# EAGLE design uru-card (EAGLE 9.6.2)
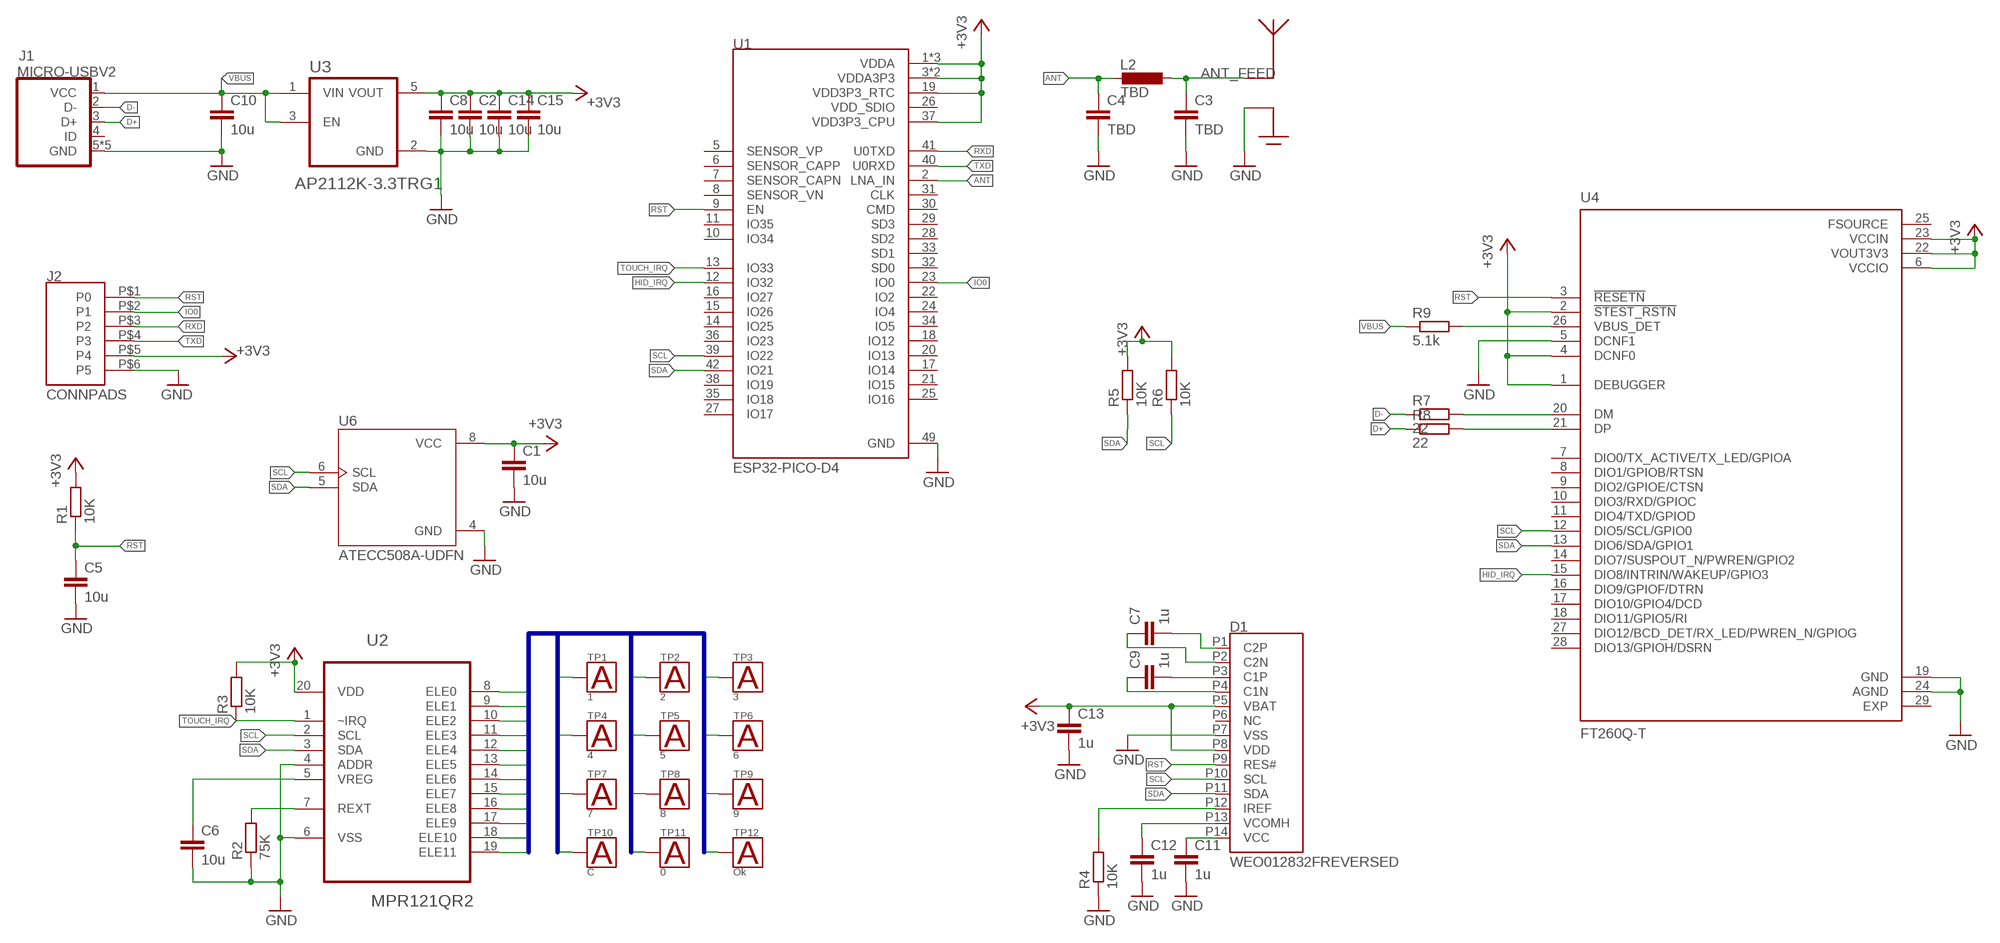
[diagram p0: schematic, sheet 1]

## Parts
C1  10u  C-EUC0603  [C0603]
C2  10u  C-EUC0603  [C0603]
C3  TBD  C-EUC0603  [C0603]
C4  TBD  C-EUC0603  [C0603]
C5  10u  C-EUC0603  [C0603]
C6  10u  C-EUC0603  [C0603]
C7  1u  C-EUC0603  [C0603]
C8  10u  C-EUC0603  [C0603]
C9  1u  C-EUC0603  [C0603]
C10  10u  C-EUC0603  [C0603]
C11  1u  C-EUC0603  [C0603]
C12  1u  C-EUC0603  [C0603]
C13  1u  C-EUC0603  [C0603]
C14  10u  C-EUC0603  [C0603]
C15  10u  C-EUC0603  [C0603]
D1  WEO012832FREVERSED  [WEO012832F-REVERSE]
J1  MICRO-USBV2  [MICRO-USB-2]
J2  CONNPADS  [PADS]
L2  TBD  L-EUL2012C  [L2012C]
R1  10K  R-EU_R0603  [R0603]
R2  75K  R-EU_R0603  [R0603]
R3  10K  R-EU_R0603  [R0603]
R4  10K  R-EU_R0603  [R0603]
R5  10K  R-EU_R0603  [R0603]
R6  10K  R-EU_R0603  [R0603]
R7  22  R-EU_R0603  [R0603]
R8  22  R-EU_R0603  [R0603]
R9  5.1k  R-EU_R0603  [R0603]
TP1  1  TOUCH  [TOUCH]
TP2  2  TOUCH  [TOUCH]
TP3  3  TOUCH  [TOUCH]
TP4  4  TOUCH  [TOUCH]
TP5  5  TOUCH  [TOUCH]
TP6  6  TOUCH  [TOUCH]
TP7  7  TOUCH  [TOUCH]
TP8  8  TOUCH  [TOUCH]
TP9  9  TOUCH  [TOUCH]
TP10  C  TOUCH  [TOUCH]
TP11  0  TOUCH  [TOUCH]
TP12  Ok  TOUCH  [TOUCH]
U1  ESP32-PICO-D4  [PQFN50P700X700X104-49N]
U2  MPR121QR2  [QFN40P300X300X60-20N]
U3  AP2112K-3.3TRG1  [SOT95P285X140-5N]
U4  FT260Q-T  [QFN50P500X500X80-29N]
U6  ATECC508A-UDFN  [SON50P200X300X60-9N]
U$15  ANT-2_4_PCB  [ANT-2_4]

## Nets
0: TP11.P$1 U2.18(ELE10)
1: TP1.P$1 U2.8(ELE0)
2: TP2.P$1 U2.9(ELE1)
3: TP3.P$1 U2.10(ELE2)
4: TP4.P$1 U2.11(ELE3)
5: TP5.P$1 U2.12(ELE4)
6: TP6.P$1 U2.13(ELE5)
7: TP7.P$1 U2.14(ELE6)
8: TP8.P$1 U2.15(ELE7)
9: TP9.P$1 U2.16(ELE8)
+3V3 [VCC]: C1.1 C2.1 C8.1 C13.1 C14.1 C15.1 D1.P5(VBAT) D1.P8(VDD) J2.P$5(P4) R1.2 R3.2 R5.2 R6.2 U1.1(VDDA) U1.3(VDDA3P3) U1.4(VDDA3P3) U1.19(VDD3P3_RTC) U1.37(VDD3P3_CPU) U1.43(VDDA) U1.46(VDDA) U2.20(VDD) U3.5(VOUT) U4.1(DEBUGGER) U4.2(!STEST_RSTN) U4.4(DCNF0) U4.6(VCCIO) U4.22(VOUT3V3) U4.23(VCCIN) U6.8(VCC)
ANT [ANT]: C4.1 L2.2 U1.2(LNA_IN)
ANT_FEED [ANT]: C3.1 L2.1 U$15.FEED
C: TP10.P$1 U2.17(ELE9)
D+: J1.3(D+) R8.1
D-: J1.2(D-) R7.1
GND [GND]: C1.2 C2.2 C3.2 C4.2 C5.2 C6.2 C8.2 C10.2 C11.2 C12.2 C13.2 C14.2 C15.2 D1.P7(VSS) J1.5(GND) J1.P$1(GND) J1.P$2(GND) J1.P$3(GND) J1.P$4(GND) J2.P$6(P5) R2.1 R4.1 U1.49(GND) U2.4(ADDR) U2.6(VSS) U3.2(GND) U4.5(DCNF1) U4.19(GND) U4.24(AGND) U6.4(GND) U$15.GND
HID_IRQ: U1.12(IO32) U4.15(DIO8/INTRIN/WAKEUP/GPIO3)
IO0: J2.P$2(P1) U1.23(IO0)
N$1: C9.1 D1.P4(C1N)
N$2: C9.2 D1.P3(C1P)
N$3: C7.1 D1.P2(C2N)
N$4: C7.2 D1.P1(C2P)
N$5: R7.2 U4.20(DM)
N$6: D1.P12(IREF) R4.2
N$7: C12.1 D1.P13(VCOMH)
N$8: C11.1 D1.P14(VCC)
N$9: R8.2 U4.21(DP)
N$17: R9.2 U4.26(VBUS_DET)
N$18: R2.2 U2.7(REXT)
N$19: C6.1 U2.5(VREG)
OK: TP12.P$1 U2.19(ELE11)
RST: C5.1 D1.P9(RES#) J2.P$1(P0) R1.1 U1.9(EN) U4.3(!RESETN)
RXD: J2.P$3(P2) U1.41(U0TXD)
SCL: D1.P10(SCL) R6.1 U1.39(IO22) U2.2(SCL) U4.12(DIO5/SCL/GPIO0) U6.6(SCL)
SDA: D1.P11(SDA) R5.1 U1.42(IO21) U2.3(SDA) U4.13(DIO6/SDA/GPIO1) U6.5(SDA)
TOUCH_IRQ: R3.1 U1.13(IO33) U2.1(~IRQ)
TXD: J2.P$4(P3) U1.40(U0RXD)
VBUS [VCC]: C10.1 J1.1(VCC) R9.1 U3.1(VIN) U3.3(EN)
Unconnected: D1.P6(NC) J1.4(ID) U1.5(SENSOR_VP) U1.6(SENSOR_CAPP) U1.7(SENSOR_CAPN) U1.8(SENSOR_VN) U1.10(IO34) U1.11(IO35) U1.14(IO25) U1.15(IO26) U1.16(IO27) U1.17(IO14) U1.18(IO12) U1.20(IO13) U1.21(IO15) U1.22(IO2) U1.24(IO4) U1.25(IO16) U1.27(IO17) U1.28(SD2) U1.29(SD3) U1.30(CMD) U1.31(CLK) U1.32(SD0) U1.33(SD1) U1.34(IO5) U1.35(IO18) U1.36(IO23) U1.38(IO19) U4.7(DIO0/TX_ACTIVE/TX_LED/GPIOA) U4.8(DIO1/GPIOB/RTSN) U4.9(DIO2/GPIOE/CTSN) U4.10(DIO3/RXD/GPIOC) U4.11(DIO4/TXD/GPIOD) U4.14(DIO7/SUSPOUT_N/PWREN/GPIO2) U4.16(DIO9/GPIOF/DTRN) U4.17(DIO10/GPIO4/DCD) U4.18(DIO11/GPIO5/RI) U4.27(DIO12/BCD_DET/RX_LED/PWREN_N/GPIOG) U4.28(DIO13/GPIOH/DSRN)

## Buses
TOUCH:0,1,2,3,4,5,6,7,8,9,C,OK

## Power pins joined to a net without a drawn wire
EXP: U4.29(EXP)
FSOURCE: U4.25(FSOURCE)
VDD_SDIO: U1.26(VDD_SDIO)

## Library data of the parts
C1-C15 = rcl:C-EU: CAPACITOR, European symbol; SPICEPREFIX: C
D1 = OLED:WEO012832F
J1 = microusb:MICRO-USB: Micro USB B connector
J2 = CONN:CONN
L2 = rcl:L-EU: INDUCTOR, European symbol; SPICEPREFIX: L
R1-R9 = rcl:R-EU_: RESISTOR, European symbol; SPICEPREFIX: R
TP1-TP12 = pads:TOUCH
U1 = ESP32-PICO-D4:ESP32-PICO-D4: The ESP32-PICO-D4 is a System-in-Package (SIP) module that is based on ESP32, providing complete Wi-Fi and Bluetooth functionalities. The module has a size as small as 7.0±0.1 mm×7.0±0.1 mm×0.94±0.1 mm, thus requiring minimal PCB area. The module integrates a 4-MB SPI flash; AVAILABILITY: Unavailable; DESCRIPTION: WIFi/Bluetooth SIP; MF: Espressif Systems; MP: ESP32-PICO-D4; PACKAGE: SMD-48 Espressif Systems; PRICE: None
U2 = MPR121QR2:MPR121QR2: Proximity Capacitive Touch Sensor Controller; AVAILABILITY: Unavailable; DESCRIPTION: Capacitive Touch Buttons, Slider, Wheel 20-QFN _3x3_; MF: NXP USA; MP: MPR121QR2; PACKAGE: QFN-20 Resurgent; PRICE: None
U3 = AP2112K-3.3TRG1:AP2112K-3.3TRG1: AP2112 Series 0.6 A 3.3 V Fixed Output SMT LDO Linear Regulator - SOT23-5; AVAILABILITY: Unavailable; DESCRIPTION: AP2112 Series 0.6 A 3.3 V Fixed Output SMT LDO Linear Regulator - SOT23-5; MF: Diodes Inc.; MP: AP2112K-3.3TRG1; PACKAGE: SOT-753 Diodes Inc.; PRICE: None
U4 = FT260Q-T:FT260Q-T: HID-class USB to UART/I2C Bridge QFN28 Tray; AVAILABILITY: Unavailable; DESCRIPTION: USB Bridge, USB to I²C/UART USB 2.0 I²C, UART Interface 28-WQFN _5x5_; MF: FTDI,; MP: FT260Q-T; PACKAGE: WQFN-28 FTDI; PRICE: None
U6 = ATECC508A:ATECC508A
U$15 = ANT:ANT-2_4_PCB: Small Size 2.4 GHz PCB antenna Based on design from Texas Instruments Application Note AN043 (https://www.ti.com/lit/an/swra117d/swra117d.pdf) The PCB antenna used on the CC2511 USB dongle reference design is described in this application note. Even if the antenna presented is for a USB dongle design it can be used in all 2.4 GHz designs, especially where small space is required for the antenna.

## Net classes
0 default: width 0.2 mm
1 VCC: width 0.25 mm
2 GND: width 0.3 mm
3 ANT: width 0.3 mm

## Board
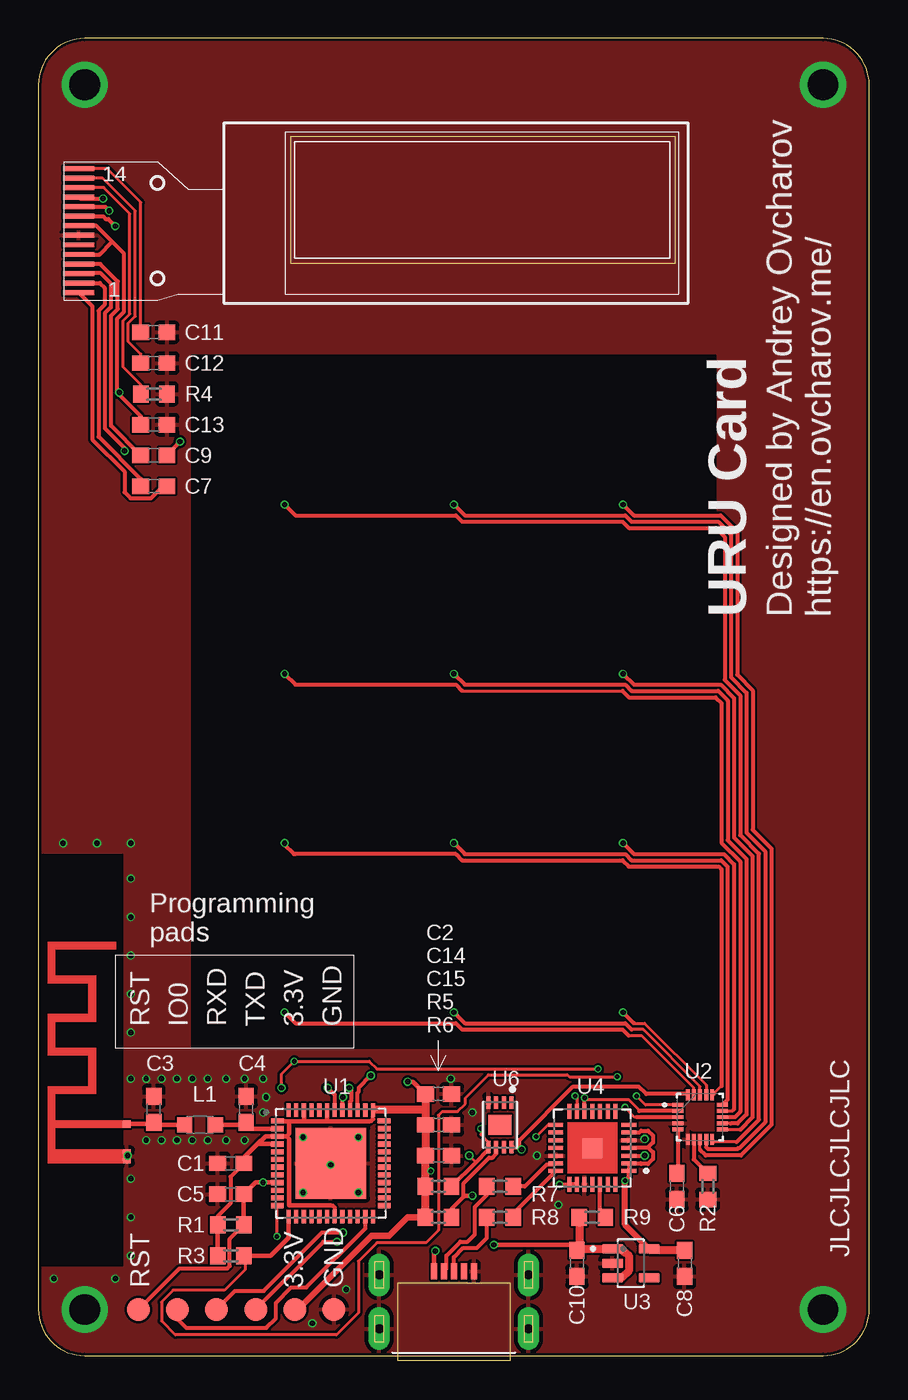
[diagram p1: board, top side]
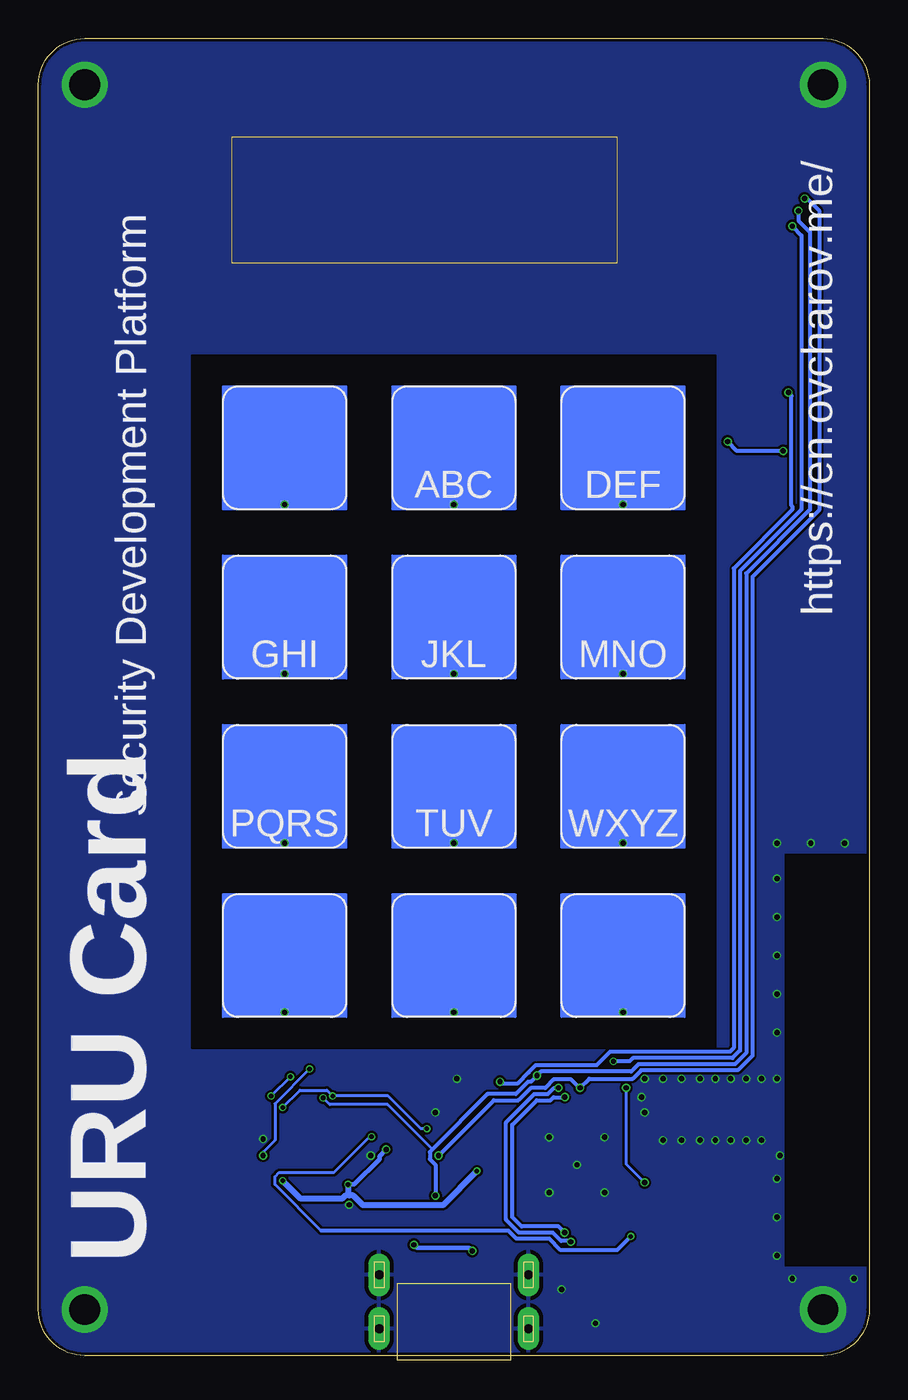
[diagram p2: board, bottom side, seen from below]

Size 54 x 85.6 mm. Coordinates in mm from the lower left corner, seen from the top.
Outline: 3,0 51,0 arc90 54,3 54,82.6 arc90 51,85.6 3,85.6 arc90 0,82.6 0,3 arc90 3,0
Copper layers (1*16): Top 0.035mm / dielectric 1.5mm / Bottom 0.035mm
Design rules "pcbway-5mil": minimum track width 6mil, minimum drill 0.3mm, track to track 6mil, track to pad 6mil, pad to pad 6mil, via to via 6mil, smd to smd 6mil, copper to edge 0.2mm, drill to drill 6mil, minimum pad ring 3mil, minimum via ring 3mil, stop-mask expansion 4mil, vias tented up to drill 0.5mm, thermal gap 10mil
tRestrict: area 0,5.8 to 5.5,12; area 0,27.2 to 5.5,32.6
bRestrict: area 0,27.2 to 5.5,32.6; area 0,5.8 to 5.5,12
Milling: area 16.4,71 to 41.4,79.2

### Footprints (pad centres in the part's own frame; a part is rotated, then mirrored left to right if it is on the bottom)
C0603 = smd 1.1 x 1: 1 -0.85,0; 2 0.85,0
WEO012832F-REVERSE = smd 2 x 0.32: P1 1.125,-10.915; P2 1.125,-10.295; P3 1.125,-9.675; P4 1.125,-9.055; P5 1.125,-8.435; P6 1.125,-7.815; P7 1.125,-7.195; P8 1.125,-6.575; P9 1.125,-5.955; P10 1.125,-5.335; P11 1.125,-4.715; P12 1.125,-4.095; P13 1.125,-3.475; P14 1.125,-2.855
MICRO-USB-2 = smd 0.4 x 1.05: 1 -1.3,5.275; 2 -0.65,5.275; 3 0,5.275; 4 0.65,5.275; 5 1.3,5.275 | drill 0.6 pad 1.4 long: P$1 -4.85,5.05; P$2 -4.85,1.55; P$3 4.85,5.05; P$4 4.85,1.55
PADS = smd 1.5 x 1.5: P$1 0,0; P$2 2.54,0; P$3 5.08,0; P$4 7.62,0; P$5 10.16,0; P$6 12.7,0
L2012C = smd 1 x 1: 1 -1,0; 2 1,0
R0603 = smd 1 x 1.1: 1 -0.85,0; 2 0.85,0
TOUCH = smd 0.5 x 0.5: P$1 0,-3.69
PQFN50P700X700X104-49N = smd 0.85 x 0.3: 1 -3.465,2.75; 2 -3.465,2.25; 3 -3.465,1.75; 4 -3.465,1.25; 5 -3.465,0.75; 6 -3.465,0.25; 7 -3.465,-0.25; 8 -3.465,-0.75; 9 -3.465,-1.25; 10 -3.465,-1.75; 11 -3.465,-2.25; 12 -3.465,-2.75; 25 3.475,-2.75; 26 3.475,-2.25; 27 3.475,-1.75; 28 3.475,-1.25; 29 3.475,-0.75; 30 3.475,-0.25; 31 3.475,0.25; 32 3.475,0.75; 33 3.475,1.25; 34 3.475,1.75; 35 3.475,2.25; 36 3.465,2.75 | smd 0.3 x 0.85: 13 -2.75,-3.465; 14 -2.25,-3.465; 15 -1.75,-3.465; 16 -1.25,-3.465; 17 -0.75,-3.465; 18 -0.25,-3.465; 19 0.25,-3.465; 20 0.75,-3.465; 21 1.25,-3.465; 22 1.75,-3.465; 23 2.25,-3.465; 24 2.75,-3.465; 37 2.75,3.465; 38 2.25,3.465; 39 1.75,3.465; 40 1.25,3.465; 41 0.75,3.465; 42 0.25,3.465; 43 -0.25,3.465; 44 -0.75,3.465; 45 -1.25,3.465; 46 -1.75,3.465; 47 -2.25,3.465; 48 -2.75,3.465 | smd 4.6 x 4.6: 49 0,0
QFN40P300X300X60-20N = smd 0.711 x 0.254: 1 -1.448,0.787; 2 -1.448,0.406; 3 -1.448,0; 4 -1.448,-0.406; 5 -1.448,-0.787; 11 1.448,-0.787; 12 1.448,-0.406; 13 1.448,0; 14 1.448,0.406; 15 1.448,0.787 | smd 0.254 x 0.711: 6 -0.787,-1.448; 7 -0.406,-1.448; 8 0,-1.448; 9 0.406,-1.448; 10 0.787,-1.448; 16 0.787,1.448; 17 0.406,1.448; 18 0,1.448; 19 -0.406,1.448; 20 -0.787,1.448
SOT95P285X140-5N = smd 1.35 x 0.6: 1 -1.185,0.95; 2 -1.185,0; 3 -1.185,-0.95; 4 1.185,-0.95; 5 1.185,0.95
QFN50P500X500X80-29N = smd 0.96 x 0.26: 1 -2.375,1.5; 2 -2.375,1; 3 -2.375,0.5; 4 -2.375,0; 5 -2.375,-0.5; 6 -2.375,-1; 7 -2.375,-1.5; 15 2.375,-1.5; 16 2.375,-1; 17 2.375,-0.5; 18 2.375,0; 19 2.375,0.5; 20 2.375,1; 21 2.375,1.5 | smd 0.26 x 0.96: 8 -1.5,-2.375; 9 -1,-2.375; 10 -0.5,-2.375; 11 0,-2.375; 12 0.5,-2.375; 13 1,-2.375; 14 1.5,-2.375; 22 1.5,2.375; 23 1,2.375; 24 0.5,2.375; 25 0,2.375; 26 -0.5,2.375; 27 -1,2.375; 28 -1.5,2.375 | smd 1.27 x 1.27: 29 0,0
SON50P200X300X60-9N = smd 0.81 x 0.26: 1 -1.45,0.75; 2 -1.45,0.25; 3 -1.45,-0.25; 4 -1.45,-0.75; 5 1.45,-0.75; 6 1.45,-0.25; 7 1.45,0.25; 8 1.45,0.75 | smd 1.3 x 1.5: 9 0,0
ANT-2_4 = smd 0.5 x 0.5: FEED 2.55,-0.25 | smd 0.9 x 0.5: GND 0.45,-0.25

### Placement (x,y rotation side)
C1  12.5,12.5 180 top
C2  26,15 0 top
C3  7.5,16 90 top
C4  13.5,16 90 top
C5  12.5,10.5 180 top
C6  41.5,11 270 top
C7  7.5,56.5 0 top
C8  42,6 270 top
C9  7.5,58.5 0 top
C10  35,6 270 top
C11  7.5,66.5 0 top
C12  7.5,64.5 0 top
C13  7.5,60.5 0 top
C14  26,17 0 top
C15  26,13 0 top
D1  1.5,80 0 top
J1  27,0.2 0 top
J2  6.5,3 0 top
L2  10.5,15 0 top
R1  12.5,8.5 180 top
R2  43.5,11 90 top
R3  12.5,6.5 180 top
R4  7.5,62.5 180 top
R5  26,11 180 top
R6  26,9 180 top
R7  30,11 0 top
R8  30,9 0 top
R9  36,9 0 top
TP1  38,59 0 bottom
TP2  27,59 0 bottom
TP3  16,59 0 bottom
TP4  38,48 0 bottom
TP5  27,48 0 bottom
TP6  16,48 0 bottom
TP7  38,37 0 bottom
TP8  27,37 0 bottom
TP9  16,37 0 bottom
TP10  38,26 0 bottom
TP11  27,26 0 bottom
TP12  16,26 0 bottom
U1  19,12.5 0 top
U2  43,15.5 0 top
U3  38.5,6 0 top
U4  36,13.5 180 top
U6  30,15 270 top
U$15  5.5,12.5 90 top

### Tracks (layer width: path | path; a pad name or v marks a point on that pad's centre or on a via)
0  (via drill 0.35)
  Top 0.2: U2.18 43,17.5 39.31,21.19 38.54,21.19
  Top 0.254: TP11.P$1 27.71,21.6 38.13,21.6 38.54,21.19
  other vias: 27,22.31
1  (via drill 0.35)
  Top 0.2: 43,13.39 U2.8
  Top 0.254: TP1.P$1 38.71,54.6 44.35,54.6 45.41,53.54 45.41,44.26 46.43,43.24 46.43,34.17 47.65,32.95 47.65,15 45.66,13.01 43.38,13.01 43,13.39
  other vias: 38,55.31
2  (via drill 0.35)
  Top 0.2: U2.9 43.41,13.58 43.39,13.57
  Top 0.254: TP2.P$1 27.71,54.6 38.13,54.6 38.54,54.19 44.18,54.19 45.01,53.37 45.01,44.09 46.03,43.07 46.03,34 47.24,32.78 47.24,15.17 45.55,13.47 45.49,13.47 45.43,13.42 43.55,13.42 43.39,13.57
  other vias: 27,55.31
3  (via drill 0.35)
  Top 0.2: 45.38,13.88 43.96,13.88 U2.10
  Top 0.254: TP3.P$1 16.71,54.6 27.14,54.6 27.54,54.19 37.97,54.19 38.37,53.79 44.01,53.79 44.6,53.2 44.6,43.92 45.62,42.91 45.62,33.83 46.84,32.61 46.84,15.34 45.38,13.88
  other vias: 16,55.31
4  (via drill 0.35)
  Top 0.2: U2.11 45.59,14.71 45.61,14.69
  Top 0.254: TP4.P$1 38.71,43.6 44.35,43.6 45.21,42.74 45.21,33.66 46.43,32.44 46.43,15.51 45.61,14.69
  other vias: 38,44.31
5  (via drill 0.35)
  Top 0.2: 45,15.09 U2.12
  Top 0.254: TP5.P$1 27.71,43.6 38.13,43.6 38.54,43.19 44.18,43.19 44.81,42.57 44.81,33.49 46.03,32.27 46.03,15.68 45.44,15.09 45,15.09
  other vias: 27,44.31
6  (via drill 0.35)
  Top 0.2: 27.54,43.19 37.97,43.19
  Top 0.254: TP6.P$1 16.71,43.6 27.14,43.6 27.54,43.19 | 37.97,43.19 38.37,42.79 44.01,42.79 44.4,42.4 44.4,33.32 45.62,32.1 45.62,15.84 45.27,15.5 U2.13
  other vias: 16,44.31
7  (via drill 0.35)
  Top 0.2: U2.14 45.11,15.91 45.2,16
  Top 0.254: TP7.P$1 38.71,32.6 44.55,32.6 45.21,31.94 45.21,16.01 45.2,16
  other vias: 38,33.31
8  (via drill 0.35)
  Top 0.2: U2.15 44.5,16.38 44.51,16.37
  Top 0.254: TP8.P$1 27.71,32.6 38.13,32.6 38.54,32.19 44.38,32.19 44.81,31.77 44.81,16.67 44.51,16.37
  other vias: 27,33.31
9  (via drill 0.35)
  Top 0.2: 44.4,17.52 43.88,17 | U2.16 43.84,17
  Top 0.25: 43.84,17 43.88,17 | 16.71,32.6 16.6,32.6 16,33.2 TP9.P$1
  Top 0.254: 16.71,32.6 27.14,32.6 27.54,32.19 37.97,32.19 38.37,31.79 44.21,31.79 44.4,31.6 44.4,17.52
  other vias: 16,33.31
+3V3  (via drill 0.3, 0.35)
  Top 0.25: 5.15,62.55 6.65,61.06 6.62,61 6.62,60.5 C13.1 | 5.15,62.55 5.12,62.59 5.12,67.41 5.57,67.86 5.57,71.6 4.78,72.38 | 4.78,72.38 3.74,73.42 D1.P8 | D1.P5 3.96,71.56 4.78,72.38 | v5.25,62.59 5.22,62.55 5.15,62.55 | C1.1 12.48,11.63 12.48,9.88 11.65,9.06 R1.2 | U6.8 31.25,13.55 | 31.25,13.55 v31.4,13.4 | 31.25,13.55 31.25,14 34.75,17.5 39,17.5 39.5,17 42.16,17 U2.20 | U1.19 19.25,9.62 19.12,9.75 19.02,9.76 | 21.52,15.24 21.62,15.25 21.75,15.38 U1.37 21.75,16 21.93,16 | U4.23 U4.22 v33.88,11.12 | v25.5,12 25.15,12 | v38.12,11.38 38.38,11.62 U4.1 U4.2 39.14,12.5 39.18,12.46 39.62,12.46 39.94,12.78 39.94,13.22 39.62,13.54 | 39.62,13.54 39.94,13.86 39.94,14.3 39.62,14.62 39.18,14.62 39.06,14.5 U4.6 | U4.4 38.41,13.54 39.62,13.54
  Top 0.3: U1.4 14.25,13.75 | C1.1 13.35,12.85 14.25,13.75 | R3.2 R1.2 | 14.25,13.75 14.75,14.25 U1.3 16.15,14.25 | 16.15,14.25 16.3,14.4 16.3,15.14 16.2,15.24 | 16.2,15.24 15.98,15.24 15.97,15.25 U1.1 | 16.2,15.24 17.3,15.24 | 17.3,15.24 18.7,15.24 | 18.7,15.24 21.52,15.24 | U1.43 18.75,15.29 18.7,15.24 | U1.46 17.25,15.29 17.3,15.24 | 16.15,14.25 16.3,14.1 16.3,9.76 19.02,9.76 | v24,17.8 24.35,17.8 C14.1
  Top 0.4: U3.5 38.12,8.51 v38.12,11.38
  Top 0.406: J2.P$5 16.86,3 21.66,7.8 22.8,7.8 24,9 R6.2
  Top 0.508: C14.1 25.15,16 | 25.15,16 C2.1 C15.1 25.15,12 R5.2 R6.2 | C8.1 39.78,6.85 U3.5 | 21.93,16 25.15,16
  Bottom 0.25: v5.25,62.59 5.05,62.39 5.05,55.25 5,55.2 5,54.97 8.8,51.17 8.8,20 9.05,19.75 16.85,19.75 17.73,18.87 21.7,18.87 22.14,18.42 22.14,18.4 22.87,17.67 23.87,17.67 v24,17.8
  Bottom 0.3: v31.4,13.4 31.84,12.96 31.84,12.77 33.48,11.12 v33.88,11.12
  Bottom 0.4: 33.8,10.41 33.55,10.41 32.92,9.79 27.71,9.79 v25.5,12 | 33.8,10.41 34.05,10.41 34.27,10.2 36.95,10.2 v38.12,11.38 | v33.88,11.12 33.88,10.49 33.8,10.41
ANT
  Top 0.3: U1.2 13.9,14.75 arc-90 C4.1 arc-90 13.35,15 L2.2
ANT_FEED
  Top 0.3: U$15.FEED 7.4,15.05 | 7.4,15.05 C3.1 | L2.1 7.45,15 arc-90 7.4,15.05
C  (via drill 0.35)
  Top 0.2: 38.71,21.6 39.4,21.6 43.41,17.59 U2.17
  Top 0.254: TP10.P$1 38.71,21.6
  other vias: 38,22.31
D+
  Top 0.254: J1.3 27,6.4 27.6,7 28.5,7 29.15,7.65 R8.1
D-
  Top 0.254: J1.2 26.52,5.65 26.52,6.5 27.43,7.41 27.9,7.41 28.37,7.88 28.37,9.67 29.15,10.45 R7.1
GND  (via drill 0.35, 2)
  other vias: 13.4,18 14.6,18 14.8,16.8 12.2,18 11,18 10,18 9,18 8,18 7,18 6,18 14.6,15.8 13.4,14 12.2,14 11,14 10,14 9,14 7,14 5.8,13 39.4,14.08 17.2,14.2 20.8,14.2 20.8,10.6 17.2,10.6 19,12.4 26.8,18 28.2,15.8 32.4,13 33.8,9.8 6,21 6,23.5 6,26 6,28.5 6,31 6,33.3 6,11.5 6,9 6,6.5 5,5 1,5 3.8,33.3 8,14 20,4.3 17.8,2.1 3,3 51,3 3,82.6 51,82.6 1.6,33.3
  pour Top: 0,0 54,0 54,86 0,86 0,27 0,13
  cutout Top: 10,65 10,20 29,20 44,20 44,65
  pour Bottom: 0,0 54,0 54,86 0,86
  cutout Bottom: 10,65 10,20 44,20 44,65
HID_IRQ  (via drill 0.3)
  Top 0.2: v15.5,7.75 15.5,9.75 U1.12 | v32.35,14.22 33.12,15 U4.15
  Bottom 0.2: 35.62,8.12 38.62,11.12 38.62,11.62 38.35,11.9 34.8,11.9 32.48,14.22 v32.35,14.22
  Bottom 0.25: v15.5,7.75 16.39,6.86 20.06,6.86 20.8,7.59 22.93,7.59 23.46,8.12 35.62,8.12
IO0
  Top 0.25: J2.P$2 9.04,2.36 9.6,1.8 14.8,1.8 15.43,2.43 15.43,3.43 16.43,4.43 17.41,4.43 21.25,8.27 U1.23
N$1
  Top 0.25: C9.1 4.71,60.44 4.71,67.57 5.17,68.02 5.17,69.8 4.02,70.94 D1.P4
N$2  (via drill 0.35)
  Top 0.25: D1.P3 2.64,70.34 4.05,70.34 4.7,69.7 4.7,68.12 4.31,67.74 4.31,60.27 5.59,58.99 v5.59,58.79 | C9.2 8.35,58.55 v9.2,59.4
  Bottom 0.25: v5.59,58.79 8.59,58.79 v9.2,59.4
N$3
  Top 0.25: D1.P2 3.99,69.7 4.3,69.4 4.3,68.29 3.91,67.91 3.91,59.71 6.65,56.97 C7.1
N$4
  Top 0.25: D1.P1 3.51,68.2 3.51,59.55 5.6,57.45 5.6,56.11 5.99,55.72 7.32,55.72 8.09,56.5 C7.2
N$5
  Top 0.254: U4.20 33.53,12.41 33.03,12.41 31.62,11 R7.2
N$6
  Top 0.2: R4.2 6.65,63.09 5.5,64.25 5.5,67.25 5.95,67.7 5.95,74.2 4.24,75.91 D1.P12
N$7
  Top 0.2: C12.1 6.65,65.09 5.85,65.89 5.85,67.11 6.3,67.56 6.3,74.4 4.17,76.53 D1.P13
N$8
  Top 0.2: C11.1 6.65,74.95 4.46,77.14 D1.P14
N$9
  Top 0.254: U4.21 30.85,9.22 R8.2
N$17
  Top 0.25: R9.2 36.5,9.35 U4.26
N$18
  Top 0.254: U2.7 42.59,12.76 R2.2
N$19
  Top 0.254: U2.5 41.55,11.9 C6.1
OK  (via drill 0.35)
  Top 0.2: U2.19 42.59,17.4 42.59,17.41 42.58,17.42 39.21,20.79 38.37,20.79
  Top 0.254: TP12.P$1 16.71,21.6 27.14,21.6 27.54,21.19 37.97,21.19 38.37,20.79
  other vias: 16,22.31
RST  (via drill 0.3, 0.35)
  Top 0.2: v36.38,18.62 22,18.62 21.5,19.12 v16.62,19.12 15.8,18.3 v15.8,17.4
  Top 0.25: D1.P9 4.19,74.05 4.38,73.86 4.54,73.86 v5,73.4 | U4.3 v39.4,13 | R1.1 12.43,7.58 12.43,5.83 12.27,5.67 9.17,5.67 J2.P$1
  Top 0.3: R1.1 C5.1 14.1,11.25 v14.6,11.25 U1.9
  Bottom 0.2: v36.38,18.62 38.62,16.38 38.62,14 39.38,13.25 39.38,13 v39.4,13 | v15.8,17.4 15.8,12.45 v14.6,11.25
  Bottom 0.25: v5,73.4 4.4,72.8 4.4,55 8.4,51 8.4,19.83 8.89,19.34 15.36,19.34 15.58,19.12 v16.62,19.12
RXD  (via drill 0.35)
  Top 0.25: J2.P$3 12.78,4.2 14.64,4.2 18.44,8 v19.8,8 | v19.79,16.8 19.75,16.76 U1.41
  Bottom 0.25: v19.8,8 20.2,8.4 22.6,8.4 23.2,9 23.2,15 21.61,16.59 20.72,16.59 20.52,16.8 v19.79,16.8
SCL  (via drill 0.3, 0.35)
  Top 0.2: 35.5,16.62 38.38,16.62 39,16 39.04,15.91 | v35.5,16.75 35.5,16.7
  Top 0.25: D1.P10 3.97,74.67 3.98,74.66 4.34,74.66 v4.6,74.4 | U1.39 20.75,17.1 20.83,17.18 20.83,17.43 v21.6,18.2 | U4.12 35.5,16.62 35.5,16.7 | U2.2 39.04,15.91
  Top 0.254: R6.1 26.85,9.55 27.63,10.33 27.63,11.21 29.29,12.87 29.5,12.87 29.75,13.12 U6.6
  Top 0.3: 27.63,10.33 27.7,10.4 v28.2,10.4
  Bottom 0.2: v35.5,16.75 35.08,16.32 31.32,16.32 28.4,13.4
  Bottom 0.25: v4.6,74.4 4.6,73.76 3.86,73.02 3.86,54.97 8,50.83 8,19.66 8.72,18.94 14.99,18.94 15.47,18.47 21.33,18.47 v21.6,18.2 22,17.8 22.17,17.8 22.97,17 24.8,17 28.4,13.4 28.57,13.23 28.57,12.77 28.2,12.4 v28.2,10.4
SDA  (via drill 0.3, 0.35)
  Top 0.2: U4.13 35,16.75 v34.88,16.88 | v38.12,16.12 38.75,15.5 38.88,15.5 | v28,13 28.43,12.57 | U6.5 29.25,13.88 28.75,14.38 v28.75,14.75
  Top 0.25: D1.P11 2.71,75.2 v4.2,75.2 | U1.42 19.25,16.95 v18.8,17.4 | U2.3 38.88,15.5
  Top 0.254: R5.1 28.43,12.57 29.25,13.4 U6.5
  Bottom 0.2: v38.12,16.12 37,17.25 35.25,17.25 v34.88,16.88 31.27,16.88 29.15,14.75 v28.75,14.75
  Bottom 0.25: v4.2,75.2 4.04,75.2 3.26,74.42 3.26,54.94 7.59,50.6 7.59,19.5 8.55,18.54 14.82,18.54 15.36,18 18.2,18 v18.8,17.4 18.84,17.4 19.38,17.94 20.51,17.94 21.05,17.4 22,17.4 22.8,16.6 24.4,16.6 v28,13
TOUCH_IRQ  (via drill 0.3)
  Top 0.2: v37.62,18.12 34.5,18.12 34.38,18.25 29.25,18.25 27.75,16.75 27.75,16.38 27.25,15.88 26.25,15.88 26,15.62 26,8.15 25.19,7.34 22,7.34 20.8,6.14 20.8,2.77 19.38,1.35 8.9,1.35 8,2.25 8,3.5 8.75,4.25 12.1,4.25 13.44,5.59 13.44,6.41 R3.1 | U2.1 39.46,16.29 v38.88,16.88
  Top 0.3: R3.1 15.1,6.5 16.25,7.65 U1.13
  Bottom 0.2: v37.62,18.12 v38.88,16.88
TXD  (via drill 0.35)
  Top 0.25: J2.P$4 18.52,7.4 v19.4,7.4 | U1.40 20.25,16.5 20.33,16.58 20.33,17.27 v20.2,17.4
  Bottom 0.25: v19.4,7.4 19.46,7.46 20.02,7.46 20.56,8 22.77,8 23.6,8.83 23.6,15.17 21.77,17 20.89,17 20.48,17.4 v20.2,17.4
VBUS  (via drill 0.35)
  Top 0.3: J1.1 25.7,6.7 v25.8,6.8 | v29.6,7.2 34.65,7.2 C10.1
  Top 0.508: R9.1 35.15,7 C10.1 35.1,6.95 U3.1 37.85,6.95 38.09,6.71 38.13,6.71 38.4,6.44 38.4,5.56 37.93,5.09 37.36,5.09 U3.3
  Bottom 0.3: v25.8,6.8 26,7 29.4,7 v29.6,7.2

### Text on the board
tPlace: URU Card | Designed by Andrey Ovcharov / https://en.ovcharov.me/
bPlace: DEF | ABC | https://en.ovcharov.me/ | MNO | JKL | GHI | WXYZ | TUV | PQRS | Security Development Platform | URU Card
tNames: C11 | C12 | R4 | C13 | C9 | C7 | Programming / pads | C2 | C14 | C15 | R5 | RST | IO0 | RXD | TXD | 3.3V | GND | R6 | C3 | C4 | U6 | U2 | U1 | U4 | L1 | C1 | C5 | R7 | R1 | R8 | R9 | C6 | R2 | R3 | JLCJLCJLCJLC | RST | 3.3V | GND | U3 | C10 | C8